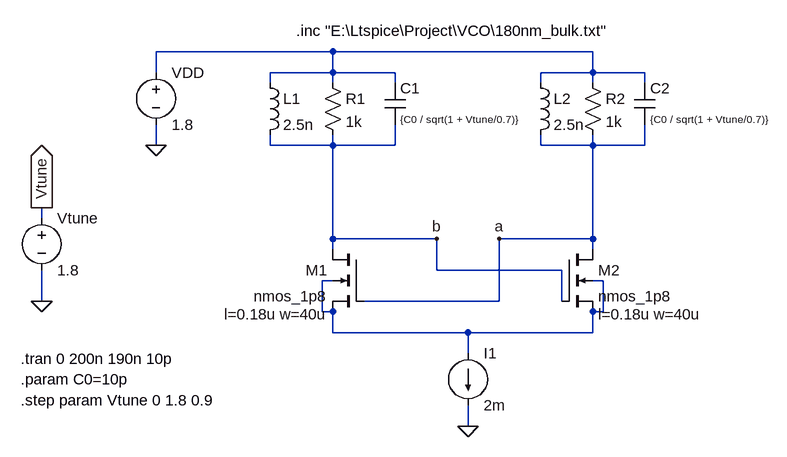
[diagram p0: schematic VCO.asc]
VCO.asc, the LTspice schematic file:
Version 4.1
SHEET 1 1260 680
WIRE 112 -192 -160 -192
WIRE 512 -192 112 -192
WIRE -160 -160 -160 -192
WIRE 112 -160 112 -192
WIRE 112 -160 16 -160
WIRE 208 -160 112 -160
WIRE 512 -160 512 -192
WIRE 512 -160 432 -160
WIRE 592 -160 512 -160
WIRE 16 -144 16 -160
WIRE 112 -144 112 -160
WIRE 208 -144 208 -160
WIRE 432 -144 432 -160
WIRE 512 -144 512 -160
WIRE 592 -144 592 -160
WIRE -160 -48 -160 -80
WIRE 16 -48 16 -64
WIRE 112 -48 112 -64
WIRE 112 -48 16 -48
WIRE 208 -48 208 -80
WIRE 208 -48 112 -48
WIRE 432 -48 432 -64
WIRE 512 -48 512 -64
WIRE 512 -48 432 -48
WIRE 592 -48 592 -80
WIRE 592 -48 512 -48
WIRE -336 64 -336 48
WIRE 112 96 112 -48
WIRE 272 96 112 96
WIRE 512 96 512 -48
WIRE 512 96 368 96
WIRE 112 112 112 96
WIRE 512 112 512 96
WIRE 272 144 272 96
WIRE 464 144 272 144
WIRE 112 160 96 160
WIRE 528 160 512 160
WIRE -336 192 -336 144
WIRE 368 192 368 96
WIRE 368 192 160 192
WIRE 464 192 464 144
WIRE 96 208 96 160
WIRE 112 208 96 208
WIRE 528 208 528 160
WIRE 528 208 512 208
WIRE 112 240 112 208
WIRE 320 240 112 240
WIRE 512 240 512 208
WIRE 512 240 320 240
WIRE 320 272 320 240
WIRE 320 384 320 352
FLAG -160 -48 0
FLAG 320 384 0
FLAG 368 96 a
FLAG 272 96 b
FLAG -336 192 0
FLAG -336 48 Vtune
IOPIN -336 48 Out
SYMBOL nmos4 160 112 M0
WINDOW 123 56 100 Left 2
SYMATTR Value2 l=0.18u w=40u
SYMATTR InstName M1
SYMATTR Value nmos_1p8
SYMBOL nmos4 464 112 R0
WINDOW 123 56 100 Left 2
SYMATTR Value2 l=0.18u w=40u
SYMATTR InstName M2
SYMATTR Value nmos_1p8
SYMBOL res 96 -160 R0
SYMATTR InstName R1
SYMATTR Value 1k
SYMBOL res 496 -160 R0
SYMATTR InstName R2
SYMATTR Value 1k
SYMBOL ind 0 -160 R0
SYMATTR InstName L1
SYMATTR Value 2.5n
SYMBOL ind 416 -160 R0
SYMATTR InstName L2
SYMATTR Value 2.5n
SYMBOL cap 192 -144 R0
WINDOW 3 24 56 Left 1
SYMATTR InstName C1
SYMATTR Value {C0 / sqrt(1 + Vtune/0.7)}
SYMBOL cap 576 -144 R0
WINDOW 3 24 56 Left 1
SYMATTR InstName C2
SYMATTR Value {C0 / sqrt(1 + Vtune/0.7)}
SYMBOL voltage -160 -176 R0
WINDOW 123 0 0 Left 0
WINDOW 39 0 0 Left 0
SYMATTR InstName VDD
SYMATTR Value 1.8
SYMBOL current 320 272 R0
WINDOW 123 0 0 Left 0
WINDOW 39 0 0 Left 0
SYMATTR InstName I1
SYMATTR Value 2m
SYMBOL voltage -336 48 R0
WINDOW 123 0 0 Left 0
WINDOW 39 0 0 Left 0
SYMATTR InstName Vtune
SYMATTR Value 1.8
TEXT -368 280 Left 2 !.tran 0 200n 190n 10p
TEXT 56 -224 Left 2 !.inc "E:\\Ltspice\\Project\\VCO\\180nm_bulk.txt"
TEXT -368 312 Left 2 !.param C0=10p
TEXT -368 344 Left 2 !.step param Vtune 0 1.8 0.9

The netlist it stands for:
* VCO.asc
M1 b a N002 N002 nmos_1p8 l=0.18u w=40u
M2 a b N002 N002 nmos_1p8 l=0.18u w=40u
R1 N001 b 1k
R2 N001 a 1k
L1 N001 b 2.5n
L2 N001 a 2.5n
C1 N001 b {C0 / sqrt(1 + Vtune/0.7)}
C2 N001 a {C0 / sqrt(1 + Vtune/0.7)}
VDD N001 0 1.8
I1 N002 0 2m
Vtune Vtune 0 1.8
.model NMOS NMOS
.model PMOS PMOS
.lib standard.mos
.tran 0 200n 190n 10p
.inc "E:\Ltspice\Project\VCO\180nm_bulk.txt"
.param C0=10p
.step param Vtune 0 1.8 0.9
.backanno
.end